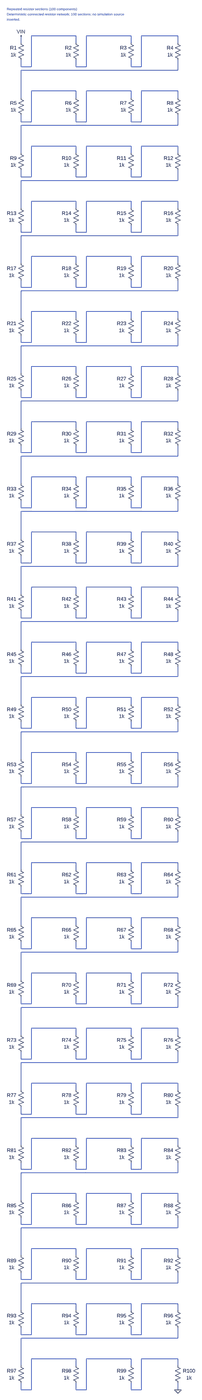
[diagram p0: schematic circuit.asc, whole sheet]
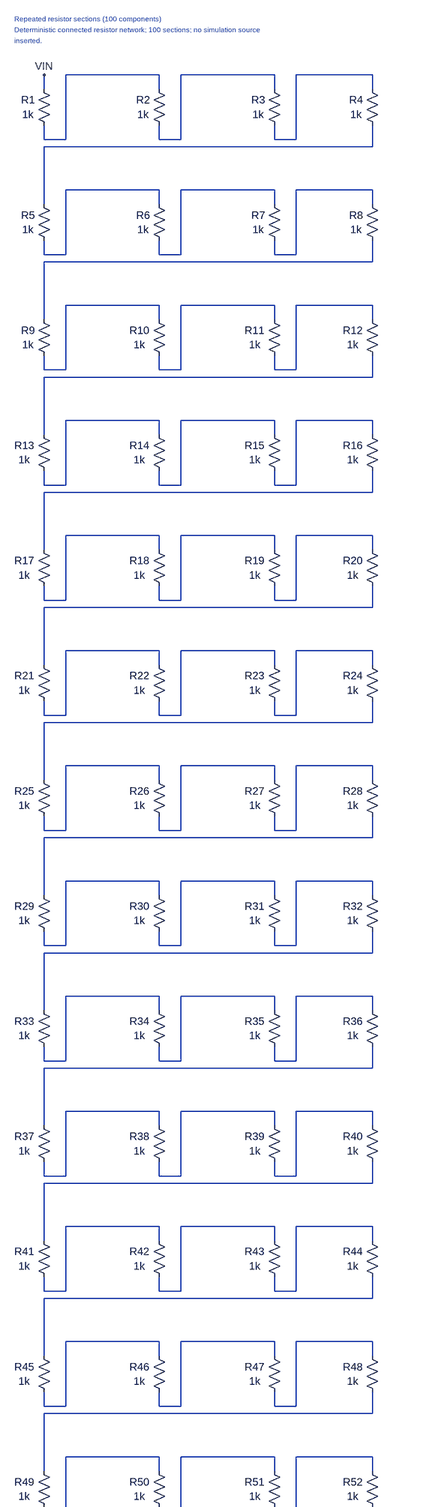
[diagram p1: schematic circuit.asc, part, row 1 of 2, column 1 of 1]
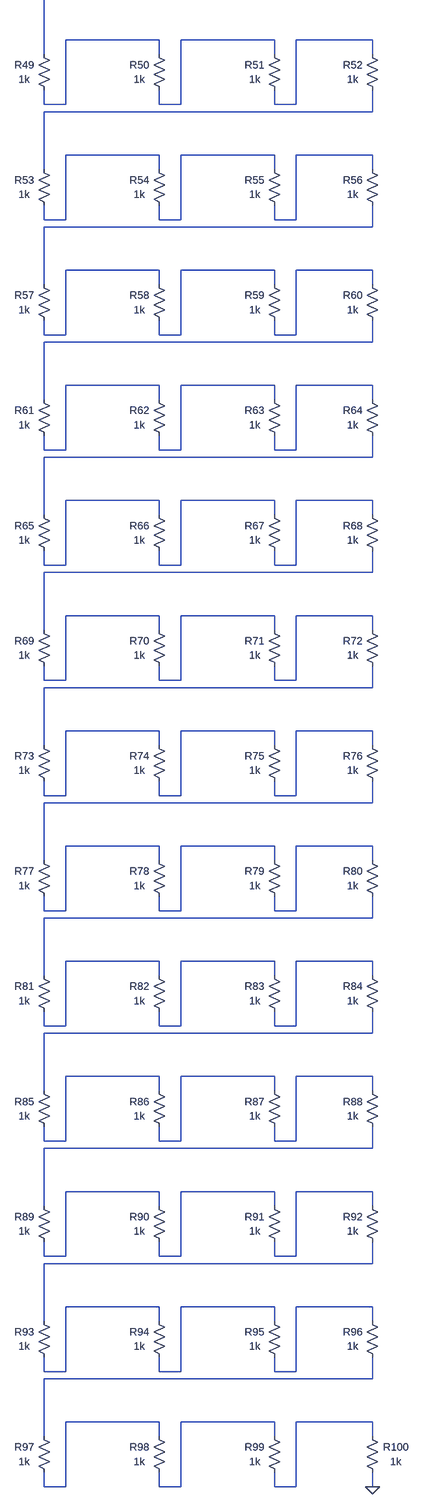
[diagram p2: schematic circuit.asc, part, row 2 of 2, column 1 of 1]
circuit.asc, the LTspice schematic file:
Version 4
SHEET 1 992 6512
SYMBOL res 64 128 R0
WINDOW 0 -20 40 Center 2
WINDOW 3 -20 72 Center 2
SYMATTR InstName R1
SYMATTR Value 1k
SYMBOL res 320 128 R0
WINDOW 0 -20 40 Center 2
WINDOW 3 -20 72 Center 2
SYMATTR InstName R2
SYMATTR Value 1k
SYMBOL res 576 128 R0
WINDOW 0 -20 40 Center 2
WINDOW 3 -20 72 Center 2
SYMATTR InstName R3
SYMATTR Value 1k
SYMBOL res 832 128 R0
WINDOW 0 -20 40 Center 2
WINDOW 3 -20 72 Center 2
SYMATTR InstName R4
SYMATTR Value 1k
SYMBOL res 64 384 R0
WINDOW 0 -20 40 Center 2
WINDOW 3 -20 72 Center 2
SYMATTR InstName R5
SYMATTR Value 1k
SYMBOL res 320 384 R0
WINDOW 0 -20 40 Center 2
WINDOW 3 -20 72 Center 2
SYMATTR InstName R6
SYMATTR Value 1k
SYMBOL res 576 384 R0
WINDOW 0 -20 40 Center 2
WINDOW 3 -20 72 Center 2
SYMATTR InstName R7
SYMATTR Value 1k
SYMBOL res 832 384 R0
WINDOW 0 -20 40 Center 2
WINDOW 3 -20 72 Center 2
SYMATTR InstName R8
SYMATTR Value 1k
SYMBOL res 64 640 R0
WINDOW 0 -20 40 Center 2
WINDOW 3 -20 72 Center 2
SYMATTR InstName R9
SYMATTR Value 1k
SYMBOL res 320 640 R0
WINDOW 0 -28 40 Center 2
WINDOW 3 -28 72 Center 2
SYMATTR InstName R10
SYMATTR Value 1k
SYMBOL res 576 640 R0
WINDOW 0 -28 40 Center 2
WINDOW 3 -28 72 Center 2
SYMATTR InstName R11
SYMATTR Value 1k
SYMBOL res 832 640 R0
WINDOW 0 -28 40 Center 2
WINDOW 3 -28 72 Center 2
SYMATTR InstName R12
SYMATTR Value 1k
SYMBOL res 64 896 R0
WINDOW 0 -28 40 Center 2
WINDOW 3 -28 72 Center 2
SYMATTR InstName R13
SYMATTR Value 1k
SYMBOL res 320 896 R0
WINDOW 0 -28 40 Center 2
WINDOW 3 -28 72 Center 2
SYMATTR InstName R14
SYMATTR Value 1k
SYMBOL res 576 896 R0
WINDOW 0 -28 40 Center 2
WINDOW 3 -28 72 Center 2
SYMATTR InstName R15
SYMATTR Value 1k
SYMBOL res 832 896 R0
WINDOW 0 -28 40 Center 2
WINDOW 3 -28 72 Center 2
SYMATTR InstName R16
SYMATTR Value 1k
SYMBOL res 64 1152 R0
WINDOW 0 -28 40 Center 2
WINDOW 3 -28 72 Center 2
SYMATTR InstName R17
SYMATTR Value 1k
SYMBOL res 320 1152 R0
WINDOW 0 -28 40 Center 2
WINDOW 3 -28 72 Center 2
SYMATTR InstName R18
SYMATTR Value 1k
SYMBOL res 576 1152 R0
WINDOW 0 -28 40 Center 2
WINDOW 3 -28 72 Center 2
SYMATTR InstName R19
SYMATTR Value 1k
SYMBOL res 832 1152 R0
WINDOW 0 -28 40 Center 2
WINDOW 3 -28 72 Center 2
SYMATTR InstName R20
SYMATTR Value 1k
SYMBOL res 64 1408 R0
WINDOW 0 -28 40 Center 2
WINDOW 3 -28 72 Center 2
SYMATTR InstName R21
SYMATTR Value 1k
SYMBOL res 320 1408 R0
WINDOW 0 -28 40 Center 2
WINDOW 3 -28 72 Center 2
SYMATTR InstName R22
SYMATTR Value 1k
SYMBOL res 576 1408 R0
WINDOW 0 -28 40 Center 2
WINDOW 3 -28 72 Center 2
SYMATTR InstName R23
SYMATTR Value 1k
SYMBOL res 832 1408 R0
WINDOW 0 -28 40 Center 2
WINDOW 3 -28 72 Center 2
SYMATTR InstName R24
SYMATTR Value 1k
SYMBOL res 64 1664 R0
WINDOW 0 -28 40 Center 2
WINDOW 3 -28 72 Center 2
SYMATTR InstName R25
SYMATTR Value 1k
SYMBOL res 320 1664 R0
WINDOW 0 -28 40 Center 2
WINDOW 3 -28 72 Center 2
SYMATTR InstName R26
SYMATTR Value 1k
SYMBOL res 576 1664 R0
WINDOW 0 -28 40 Center 2
WINDOW 3 -28 72 Center 2
SYMATTR InstName R27
SYMATTR Value 1k
SYMBOL res 832 1664 R0
WINDOW 0 -28 40 Center 2
WINDOW 3 -28 72 Center 2
SYMATTR InstName R28
SYMATTR Value 1k
SYMBOL res 64 1920 R0
WINDOW 0 -28 40 Center 2
WINDOW 3 -28 72 Center 2
SYMATTR InstName R29
SYMATTR Value 1k
SYMBOL res 320 1920 R0
WINDOW 0 -28 40 Center 2
WINDOW 3 -28 72 Center 2
SYMATTR InstName R30
SYMATTR Value 1k
SYMBOL res 576 1920 R0
WINDOW 0 -28 40 Center 2
WINDOW 3 -28 72 Center 2
SYMATTR InstName R31
SYMATTR Value 1k
SYMBOL res 832 1920 R0
WINDOW 0 -28 40 Center 2
WINDOW 3 -28 72 Center 2
SYMATTR InstName R32
SYMATTR Value 1k
SYMBOL res 64 2176 R0
WINDOW 0 -28 40 Center 2
WINDOW 3 -28 72 Center 2
SYMATTR InstName R33
SYMATTR Value 1k
SYMBOL res 320 2176 R0
WINDOW 0 -28 40 Center 2
WINDOW 3 -28 72 Center 2
SYMATTR InstName R34
SYMATTR Value 1k
SYMBOL res 576 2176 R0
WINDOW 0 -28 40 Center 2
WINDOW 3 -28 72 Center 2
SYMATTR InstName R35
SYMATTR Value 1k
SYMBOL res 832 2176 R0
WINDOW 0 -28 40 Center 2
WINDOW 3 -28 72 Center 2
SYMATTR InstName R36
SYMATTR Value 1k
SYMBOL res 64 2432 R0
WINDOW 0 -28 40 Center 2
WINDOW 3 -28 72 Center 2
SYMATTR InstName R37
SYMATTR Value 1k
SYMBOL res 320 2432 R0
WINDOW 0 -28 40 Center 2
WINDOW 3 -28 72 Center 2
SYMATTR InstName R38
SYMATTR Value 1k
SYMBOL res 576 2432 R0
WINDOW 0 -28 40 Center 2
WINDOW 3 -28 72 Center 2
SYMATTR InstName R39
SYMATTR Value 1k
SYMBOL res 832 2432 R0
WINDOW 0 -28 40 Center 2
WINDOW 3 -28 72 Center 2
SYMATTR InstName R40
SYMATTR Value 1k
SYMBOL res 64 2688 R0
WINDOW 0 -28 40 Center 2
WINDOW 3 -28 72 Center 2
SYMATTR InstName R41
SYMATTR Value 1k
SYMBOL res 320 2688 R0
WINDOW 0 -28 40 Center 2
WINDOW 3 -28 72 Center 2
SYMATTR InstName R42
SYMATTR Value 1k
SYMBOL res 576 2688 R0
WINDOW 0 -28 40 Center 2
WINDOW 3 -28 72 Center 2
SYMATTR InstName R43
SYMATTR Value 1k
SYMBOL res 832 2688 R0
WINDOW 0 -28 40 Center 2
WINDOW 3 -28 72 Center 2
SYMATTR InstName R44
SYMATTR Value 1k
SYMBOL res 64 2944 R0
WINDOW 0 -28 40 Center 2
WINDOW 3 -28 72 Center 2
SYMATTR InstName R45
SYMATTR Value 1k
SYMBOL res 320 2944 R0
WINDOW 0 -28 40 Center 2
WINDOW 3 -28 72 Center 2
SYMATTR InstName R46
SYMATTR Value 1k
SYMBOL res 576 2944 R0
WINDOW 0 -28 40 Center 2
WINDOW 3 -28 72 Center 2
SYMATTR InstName R47
SYMATTR Value 1k
SYMBOL res 832 2944 R0
WINDOW 0 -28 40 Center 2
WINDOW 3 -28 72 Center 2
SYMATTR InstName R48
SYMATTR Value 1k
SYMBOL res 64 3200 R0
WINDOW 0 -28 40 Center 2
WINDOW 3 -28 72 Center 2
SYMATTR InstName R49
SYMATTR Value 1k
SYMBOL res 320 3200 R0
WINDOW 0 -28 40 Center 2
WINDOW 3 -28 72 Center 2
SYMATTR InstName R50
SYMATTR Value 1k
SYMBOL res 576 3200 R0
WINDOW 0 -28 40 Center 2
WINDOW 3 -28 72 Center 2
SYMATTR InstName R51
SYMATTR Value 1k
SYMBOL res 832 3200 R0
WINDOW 0 -28 40 Center 2
WINDOW 3 -28 72 Center 2
SYMATTR InstName R52
SYMATTR Value 1k
SYMBOL res 64 3456 R0
WINDOW 0 -28 40 Center 2
WINDOW 3 -28 72 Center 2
SYMATTR InstName R53
SYMATTR Value 1k
SYMBOL res 320 3456 R0
WINDOW 0 -28 40 Center 2
WINDOW 3 -28 72 Center 2
SYMATTR InstName R54
SYMATTR Value 1k
SYMBOL res 576 3456 R0
WINDOW 0 -28 40 Center 2
WINDOW 3 -28 72 Center 2
SYMATTR InstName R55
SYMATTR Value 1k
SYMBOL res 832 3456 R0
WINDOW 0 -28 40 Center 2
WINDOW 3 -28 72 Center 2
SYMATTR InstName R56
SYMATTR Value 1k
SYMBOL res 64 3712 R0
WINDOW 0 -28 40 Center 2
WINDOW 3 -28 72 Center 2
SYMATTR InstName R57
SYMATTR Value 1k
SYMBOL res 320 3712 R0
WINDOW 0 -28 40 Center 2
WINDOW 3 -28 72 Center 2
SYMATTR InstName R58
SYMATTR Value 1k
SYMBOL res 576 3712 R0
WINDOW 0 -28 40 Center 2
WINDOW 3 -28 72 Center 2
SYMATTR InstName R59
SYMATTR Value 1k
SYMBOL res 832 3712 R0
WINDOW 0 -28 40 Center 2
WINDOW 3 -28 72 Center 2
SYMATTR InstName R60
SYMATTR Value 1k
SYMBOL res 64 3968 R0
WINDOW 0 -28 40 Center 2
WINDOW 3 -28 72 Center 2
SYMATTR InstName R61
SYMATTR Value 1k
SYMBOL res 320 3968 R0
WINDOW 0 -28 40 Center 2
WINDOW 3 -28 72 Center 2
SYMATTR InstName R62
SYMATTR Value 1k
SYMBOL res 576 3968 R0
WINDOW 0 -28 40 Center 2
WINDOW 3 -28 72 Center 2
SYMATTR InstName R63
SYMATTR Value 1k
SYMBOL res 832 3968 R0
WINDOW 0 -28 40 Center 2
WINDOW 3 -28 72 Center 2
SYMATTR InstName R64
SYMATTR Value 1k
SYMBOL res 64 4224 R0
WINDOW 0 -28 40 Center 2
WINDOW 3 -28 72 Center 2
SYMATTR InstName R65
SYMATTR Value 1k
SYMBOL res 320 4224 R0
WINDOW 0 -28 40 Center 2
WINDOW 3 -28 72 Center 2
SYMATTR InstName R66
SYMATTR Value 1k
SYMBOL res 576 4224 R0
WINDOW 0 -28 40 Center 2
WINDOW 3 -28 72 Center 2
SYMATTR InstName R67
SYMATTR Value 1k
SYMBOL res 832 4224 R0
WINDOW 0 -28 40 Center 2
WINDOW 3 -28 72 Center 2
SYMATTR InstName R68
SYMATTR Value 1k
SYMBOL res 64 4480 R0
WINDOW 0 -28 40 Center 2
WINDOW 3 -28 72 Center 2
SYMATTR InstName R69
SYMATTR Value 1k
SYMBOL res 320 4480 R0
WINDOW 0 -28 40 Center 2
WINDOW 3 -28 72 Center 2
SYMATTR InstName R70
SYMATTR Value 1k
SYMBOL res 576 4480 R0
WINDOW 0 -28 40 Center 2
WINDOW 3 -28 72 Center 2
SYMATTR InstName R71
SYMATTR Value 1k
SYMBOL res 832 4480 R0
WINDOW 0 -28 40 Center 2
WINDOW 3 -28 72 Center 2
SYMATTR InstName R72
SYMATTR Value 1k
SYMBOL res 64 4736 R0
WINDOW 0 -28 40 Center 2
WINDOW 3 -28 72 Center 2
SYMATTR InstName R73
SYMATTR Value 1k
SYMBOL res 320 4736 R0
WINDOW 0 -28 40 Center 2
WINDOW 3 -28 72 Center 2
SYMATTR InstName R74
SYMATTR Value 1k
SYMBOL res 576 4736 R0
WINDOW 0 -28 40 Center 2
WINDOW 3 -28 72 Center 2
SYMATTR InstName R75
SYMATTR Value 1k
SYMBOL res 832 4736 R0
WINDOW 0 -28 40 Center 2
WINDOW 3 -28 72 Center 2
SYMATTR InstName R76
SYMATTR Value 1k
SYMBOL res 64 4992 R0
WINDOW 0 -28 40 Center 2
WINDOW 3 -28 72 Center 2
SYMATTR InstName R77
SYMATTR Value 1k
SYMBOL res 320 4992 R0
WINDOW 0 -28 40 Center 2
WINDOW 3 -28 72 Center 2
SYMATTR InstName R78
SYMATTR Value 1k
SYMBOL res 576 4992 R0
WINDOW 0 -28 40 Center 2
WINDOW 3 -28 72 Center 2
SYMATTR InstName R79
SYMATTR Value 1k
SYMBOL res 832 4992 R0
WINDOW 0 -28 40 Center 2
WINDOW 3 -28 72 Center 2
SYMATTR InstName R80
SYMATTR Value 1k
SYMBOL res 64 5248 R0
WINDOW 0 -28 40 Center 2
WINDOW 3 -28 72 Center 2
SYMATTR InstName R81
SYMATTR Value 1k
SYMBOL res 320 5248 R0
WINDOW 0 -28 40 Center 2
WINDOW 3 -28 72 Center 2
SYMATTR InstName R82
SYMATTR Value 1k
SYMBOL res 576 5248 R0
WINDOW 0 -28 40 Center 2
WINDOW 3 -28 72 Center 2
SYMATTR InstName R83
SYMATTR Value 1k
SYMBOL res 832 5248 R0
WINDOW 0 -28 40 Center 2
WINDOW 3 -28 72 Center 2
SYMATTR InstName R84
SYMATTR Value 1k
SYMBOL res 64 5504 R0
WINDOW 0 -28 40 Center 2
WINDOW 3 -28 72 Center 2
SYMATTR InstName R85
SYMATTR Value 1k
SYMBOL res 320 5504 R0
WINDOW 0 -28 40 Center 2
WINDOW 3 -28 72 Center 2
SYMATTR InstName R86
SYMATTR Value 1k
SYMBOL res 576 5504 R0
WINDOW 0 -28 40 Center 2
WINDOW 3 -28 72 Center 2
SYMATTR InstName R87
SYMATTR Value 1k
SYMBOL res 832 5504 R0
WINDOW 0 -28 40 Center 2
WINDOW 3 -28 72 Center 2
SYMATTR InstName R88
SYMATTR Value 1k
SYMBOL res 64 5760 R0
WINDOW 0 -28 40 Center 2
WINDOW 3 -28 72 Center 2
SYMATTR InstName R89
SYMATTR Value 1k
SYMBOL res 320 5760 R0
WINDOW 0 -28 40 Center 2
WINDOW 3 -28 72 Center 2
SYMATTR InstName R90
SYMATTR Value 1k
SYMBOL res 576 5760 R0
WINDOW 0 -28 40 Center 2
WINDOW 3 -28 72 Center 2
SYMATTR InstName R91
SYMATTR Value 1k
SYMBOL res 832 5760 R0
WINDOW 0 -28 40 Center 2
WINDOW 3 -28 72 Center 2
SYMATTR InstName R92
SYMATTR Value 1k
SYMBOL res 64 6016 R0
WINDOW 0 -28 40 Center 2
WINDOW 3 -28 72 Center 2
SYMATTR InstName R93
SYMATTR Value 1k
SYMBOL res 320 6016 R0
WINDOW 0 -28 40 Center 2
WINDOW 3 -28 72 Center 2
SYMATTR InstName R94
SYMATTR Value 1k
SYMBOL res 576 6016 R0
WINDOW 0 -28 40 Center 2
WINDOW 3 -28 72 Center 2
SYMATTR InstName R95
SYMATTR Value 1k
SYMBOL res 832 6016 R0
WINDOW 0 -28 40 Center 2
WINDOW 3 -28 72 Center 2
SYMATTR InstName R96
SYMATTR Value 1k
SYMBOL res 64 6272 R0
WINDOW 0 -28 40 Center 2
WINDOW 3 -28 72 Center 2
SYMATTR InstName R97
SYMATTR Value 1k
SYMBOL res 320 6272 R0
WINDOW 0 -28 40 Center 2
WINDOW 3 -28 72 Center 2
SYMATTR InstName R98
SYMATTR Value 1k
SYMBOL res 576 6272 R0
WINDOW 0 -28 40 Center 2
WINDOW 3 -28 72 Center 2
SYMATTR InstName R99
SYMATTR Value 1k
SYMBOL res 832 6272 R0
WINDOW 0 68 40 Center 2
WINDOW 3 68 72 Center 2
SYMATTR InstName R100
SYMATTR Value 1k
WIRE 80 112 80 144
WIRE 80 224 80 256
WIRE 80 256 128 256
WIRE 80 272 80 400
WIRE 80 272 848 272
WIRE 80 480 80 512
WIRE 80 512 128 512
WIRE 80 528 80 656
WIRE 80 528 848 528
WIRE 80 736 80 768
WIRE 80 768 128 768
WIRE 80 784 80 912
WIRE 80 784 848 784
WIRE 80 992 80 1024
WIRE 80 1024 128 1024
WIRE 80 1040 80 1168
WIRE 80 1040 848 1040
WIRE 80 1248 80 1280
WIRE 80 1280 128 1280
WIRE 80 1296 80 1424
WIRE 80 1296 848 1296
WIRE 80 1504 80 1536
WIRE 80 1536 128 1536
WIRE 80 1552 80 1680
WIRE 80 1552 848 1552
WIRE 80 1760 80 1792
WIRE 80 1792 128 1792
WIRE 80 1808 80 1936
WIRE 80 1808 848 1808
WIRE 80 2016 80 2048
WIRE 80 2048 128 2048
WIRE 80 2064 80 2192
WIRE 80 2064 848 2064
WIRE 80 2272 80 2304
WIRE 80 2304 128 2304
WIRE 80 2320 80 2448
WIRE 80 2320 848 2320
WIRE 80 2528 80 2560
WIRE 80 2560 128 2560
WIRE 80 2576 80 2704
WIRE 80 2576 848 2576
WIRE 80 2784 80 2816
WIRE 80 2816 128 2816
WIRE 80 2832 80 2960
WIRE 80 2832 848 2832
WIRE 80 3040 80 3072
WIRE 80 3072 128 3072
WIRE 80 3088 80 3216
WIRE 80 3088 848 3088
WIRE 80 3296 80 3328
WIRE 80 3328 128 3328
WIRE 80 3344 80 3472
WIRE 80 3344 848 3344
WIRE 80 3552 80 3584
WIRE 80 3584 128 3584
WIRE 80 3600 80 3728
WIRE 80 3600 848 3600
WIRE 80 3808 80 3840
WIRE 80 3840 128 3840
WIRE 80 3856 80 3984
WIRE 80 3856 848 3856
WIRE 80 4064 80 4096
WIRE 80 4096 128 4096
WIRE 80 4112 80 4240
WIRE 80 4112 848 4112
WIRE 80 4320 80 4352
WIRE 80 4352 128 4352
WIRE 80 4368 80 4496
WIRE 80 4368 848 4368
WIRE 80 4576 80 4608
WIRE 80 4608 128 4608
WIRE 80 4624 80 4752
WIRE 80 4624 848 4624
WIRE 80 4832 80 4864
WIRE 80 4864 128 4864
WIRE 80 4880 80 5008
WIRE 80 4880 848 4880
WIRE 80 5088 80 5120
WIRE 80 5120 128 5120
WIRE 80 5136 80 5264
WIRE 80 5136 848 5136
WIRE 80 5344 80 5376
WIRE 80 5376 128 5376
WIRE 80 5392 80 5520
WIRE 80 5392 848 5392
WIRE 80 5600 80 5632
WIRE 80 5632 128 5632
WIRE 80 5648 80 5776
WIRE 80 5648 848 5648
WIRE 80 5856 80 5888
WIRE 80 5888 128 5888
WIRE 80 5904 80 6032
WIRE 80 5904 848 5904
WIRE 80 6112 80 6144
WIRE 80 6144 128 6144
WIRE 80 6160 80 6288
WIRE 80 6160 848 6160
WIRE 80 6368 80 6400
WIRE 80 6400 128 6400
WIRE 128 112 128 256
WIRE 128 112 336 112
WIRE 128 368 128 512
WIRE 128 368 336 368
WIRE 128 624 128 768
WIRE 128 624 336 624
WIRE 128 880 128 1024
WIRE 128 880 336 880
WIRE 128 1136 128 1280
WIRE 128 1136 336 1136
WIRE 128 1392 128 1536
WIRE 128 1392 336 1392
WIRE 128 1648 128 1792
WIRE 128 1648 336 1648
WIRE 128 1904 128 2048
WIRE 128 1904 336 1904
WIRE 128 2160 128 2304
WIRE 128 2160 336 2160
WIRE 128 2416 128 2560
WIRE 128 2416 336 2416
WIRE 128 2672 128 2816
WIRE 128 2672 336 2672
WIRE 128 2928 128 3072
WIRE 128 2928 336 2928
WIRE 128 3184 128 3328
WIRE 128 3184 336 3184
WIRE 128 3440 128 3584
WIRE 128 3440 336 3440
WIRE 128 3696 128 3840
WIRE 128 3696 336 3696
WIRE 128 3952 128 4096
WIRE 128 3952 336 3952
WIRE 128 4208 128 4352
WIRE 128 4208 336 4208
WIRE 128 4464 128 4608
WIRE 128 4464 336 4464
WIRE 128 4720 128 4864
WIRE 128 4720 336 4720
WIRE 128 4976 128 5120
WIRE 128 4976 336 4976
WIRE 128 5232 128 5376
WIRE 128 5232 336 5232
WIRE 128 5488 128 5632
WIRE 128 5488 336 5488
WIRE 128 5744 128 5888
WIRE 128 5744 336 5744
WIRE 128 6000 128 6144
WIRE 128 6000 336 6000
WIRE 128 6256 128 6400
WIRE 128 6256 336 6256
WIRE 336 112 336 144
WIRE 336 224 336 256
WIRE 336 256 384 256
WIRE 336 368 336 400
WIRE 336 480 336 512
WIRE 336 512 384 512
WIRE 336 624 336 656
WIRE 336 736 336 768
WIRE 336 768 384 768
WIRE 336 880 336 912
WIRE 336 992 336 1024
WIRE 336 1024 384 1024
WIRE 336 1136 336 1168
WIRE 336 1248 336 1280
WIRE 336 1280 384 1280
WIRE 336 1392 336 1424
WIRE 336 1504 336 1536
WIRE 336 1536 384 1536
WIRE 336 1648 336 1680
WIRE 336 1760 336 1792
WIRE 336 1792 384 1792
WIRE 336 1904 336 1936
WIRE 336 2016 336 2048
WIRE 336 2048 384 2048
WIRE 336 2160 336 2192
WIRE 336 2272 336 2304
WIRE 336 2304 384 2304
WIRE 336 2416 336 2448
WIRE 336 2528 336 2560
WIRE 336 2560 384 2560
WIRE 336 2672 336 2704
WIRE 336 2784 336 2816
WIRE 336 2816 384 2816
WIRE 336 2928 336 2960
WIRE 336 3040 336 3072
WIRE 336 3072 384 3072
WIRE 336 3184 336 3216
WIRE 336 3296 336 3328
WIRE 336 3328 384 3328
WIRE 336 3440 336 3472
WIRE 336 3552 336 3584
WIRE 336 3584 384 3584
WIRE 336 3696 336 3728
WIRE 336 3808 336 3840
WIRE 336 3840 384 3840
WIRE 336 3952 336 3984
WIRE 336 4064 336 4096
WIRE 336 4096 384 4096
WIRE 336 4208 336 4240
WIRE 336 4320 336 4352
WIRE 336 4352 384 4352
WIRE 336 4464 336 4496
WIRE 336 4576 336 4608
WIRE 336 4608 384 4608
WIRE 336 4720 336 4752
WIRE 336 4832 336 4864
WIRE 336 4864 384 4864
WIRE 336 4976 336 5008
WIRE 336 5088 336 5120
WIRE 336 5120 384 5120
WIRE 336 5232 336 5264
WIRE 336 5344 336 5376
WIRE 336 5376 384 5376
WIRE 336 5488 336 5520
WIRE 336 5600 336 5632
WIRE 336 5632 384 5632
WIRE 336 5744 336 5776
WIRE 336 5856 336 5888
WIRE 336 5888 384 5888
WIRE 336 6000 336 6032
WIRE 336 6112 336 6144
WIRE 336 6144 384 6144
WIRE 336 6256 336 6288
WIRE 336 6368 336 6400
WIRE 336 6400 384 6400
WIRE 384 112 384 256
WIRE 384 112 592 112
WIRE 384 368 384 512
WIRE 384 368 592 368
WIRE 384 624 384 768
WIRE 384 624 592 624
WIRE 384 880 384 1024
WIRE 384 880 592 880
WIRE 384 1136 384 1280
WIRE 384 1136 592 1136
WIRE 384 1392 384 1536
WIRE 384 1392 592 1392
WIRE 384 1648 384 1792
WIRE 384 1648 592 1648
WIRE 384 1904 384 2048
WIRE 384 1904 592 1904
WIRE 384 2160 384 2304
WIRE 384 2160 592 2160
WIRE 384 2416 384 2560
WIRE 384 2416 592 2416
WIRE 384 2672 384 2816
WIRE 384 2672 592 2672
WIRE 384 2928 384 3072
WIRE 384 2928 592 2928
WIRE 384 3184 384 3328
WIRE 384 3184 592 3184
WIRE 384 3440 384 3584
WIRE 384 3440 592 3440
WIRE 384 3696 384 3840
WIRE 384 3696 592 3696
WIRE 384 3952 384 4096
WIRE 384 3952 592 3952
WIRE 384 4208 384 4352
WIRE 384 4208 592 4208
WIRE 384 4464 384 4608
WIRE 384 4464 592 4464
WIRE 384 4720 384 4864
WIRE 384 4720 592 4720
WIRE 384 4976 384 5120
WIRE 384 4976 592 4976
WIRE 384 5232 384 5376
WIRE 384 5232 592 5232
WIRE 384 5488 384 5632
WIRE 384 5488 592 5488
WIRE 384 5744 384 5888
WIRE 384 5744 592 5744
WIRE 384 6000 384 6144
WIRE 384 6000 592 6000
WIRE 384 6256 384 6400
WIRE 384 6256 592 6256
WIRE 592 112 592 144
WIRE 592 224 592 256
WIRE 592 256 640 256
WIRE 592 368 592 400
WIRE 592 480 592 512
WIRE 592 512 640 512
WIRE 592 624 592 656
WIRE 592 736 592 768
WIRE 592 768 640 768
WIRE 592 880 592 912
WIRE 592 992 592 1024
WIRE 592 1024 640 1024
WIRE 592 1136 592 1168
WIRE 592 1248 592 1280
WIRE 592 1280 640 1280
WIRE 592 1392 592 1424
WIRE 592 1504 592 1536
WIRE 592 1536 640 1536
WIRE 592 1648 592 1680
WIRE 592 1760 592 1792
WIRE 592 1792 640 1792
WIRE 592 1904 592 1936
WIRE 592 2016 592 2048
WIRE 592 2048 640 2048
WIRE 592 2160 592 2192
WIRE 592 2272 592 2304
WIRE 592 2304 640 2304
WIRE 592 2416 592 2448
WIRE 592 2528 592 2560
WIRE 592 2560 640 2560
WIRE 592 2672 592 2704
WIRE 592 2784 592 2816
WIRE 592 2816 640 2816
WIRE 592 2928 592 2960
WIRE 592 3040 592 3072
WIRE 592 3072 640 3072
WIRE 592 3184 592 3216
WIRE 592 3296 592 3328
WIRE 592 3328 640 3328
WIRE 592 3440 592 3472
WIRE 592 3552 592 3584
WIRE 592 3584 640 3584
WIRE 592 3696 592 3728
WIRE 592 3808 592 3840
WIRE 592 3840 640 3840
WIRE 592 3952 592 3984
WIRE 592 4064 592 4096
WIRE 592 4096 640 4096
WIRE 592 4208 592 4240
WIRE 592 4320 592 4352
WIRE 592 4352 640 4352
WIRE 592 4464 592 4496
WIRE 592 4576 592 4608
WIRE 592 4608 640 4608
WIRE 592 4720 592 4752
WIRE 592 4832 592 4864
WIRE 592 4864 640 4864
WIRE 592 4976 592 5008
WIRE 592 5088 592 5120
WIRE 592 5120 640 5120
WIRE 592 5232 592 5264
WIRE 592 5344 592 5376
WIRE 592 5376 640 5376
WIRE 592 5488 592 5520
WIRE 592 5600 592 5632
WIRE 592 5632 640 5632
WIRE 592 5744 592 5776
WIRE 592 5856 592 5888
WIRE 592 5888 640 5888
WIRE 592 6000 592 6032
WIRE 592 6112 592 6144
WIRE 592 6144 640 6144
WIRE 592 6256 592 6288
WIRE 592 6368 592 6400
WIRE 592 6400 640 6400
WIRE 640 112 640 256
WIRE 640 112 848 112
WIRE 640 368 640 512
WIRE 640 368 848 368
WIRE 640 624 640 768
WIRE 640 624 848 624
WIRE 640 880 640 1024
WIRE 640 880 848 880
WIRE 640 1136 640 1280
WIRE 640 1136 848 1136
WIRE 640 1392 640 1536
WIRE 640 1392 848 1392
WIRE 640 1648 640 1792
WIRE 640 1648 848 1648
WIRE 640 1904 640 2048
WIRE 640 1904 848 1904
WIRE 640 2160 640 2304
WIRE 640 2160 848 2160
WIRE 640 2416 640 2560
WIRE 640 2416 848 2416
WIRE 640 2672 640 2816
WIRE 640 2672 848 2672
WIRE 640 2928 640 3072
WIRE 640 2928 848 2928
WIRE 640 3184 640 3328
WIRE 640 3184 848 3184
WIRE 640 3440 640 3584
WIRE 640 3440 848 3440
WIRE 640 3696 640 3840
WIRE 640 3696 848 3696
WIRE 640 3952 640 4096
WIRE 640 3952 848 3952
WIRE 640 4208 640 4352
WIRE 640 4208 848 4208
WIRE 640 4464 640 4608
WIRE 640 4464 848 4464
WIRE 640 4720 640 4864
WIRE 640 4720 848 4720
WIRE 640 4976 640 5120
WIRE 640 4976 848 4976
WIRE 640 5232 640 5376
WIRE 640 5232 848 5232
WIRE 640 5488 640 5632
WIRE 640 5488 848 5488
WIRE 640 5744 640 5888
WIRE 640 5744 848 5744
WIRE 640 6000 640 6144
WIRE 640 6000 848 6000
WIRE 640 6256 640 6400
WIRE 640 6256 848 6256
WIRE 848 112 848 144
WIRE 848 224 848 272
WIRE 848 368 848 400
WIRE 848 480 848 528
WIRE 848 624 848 656
WIRE 848 736 848 784
WIRE 848 880 848 912
WIRE 848 992 848 1040
WIRE 848 1136 848 1168
WIRE 848 1248 848 1296
WIRE 848 1392 848 1424
WIRE 848 1504 848 1552
WIRE 848 1648 848 1680
WIRE 848 1760 848 1808
WIRE 848 1904 848 1936
WIRE 848 2016 848 2064
WIRE 848 2160 848 2192
WIRE 848 2272 848 2320
WIRE 848 2416 848 2448
WIRE 848 2528 848 2576
WIRE 848 2672 848 2704
WIRE 848 2784 848 2832
WIRE 848 2928 848 2960
WIRE 848 3040 848 3088
WIRE 848 3184 848 3216
WIRE 848 3296 848 3344
WIRE 848 3440 848 3472
WIRE 848 3552 848 3600
WIRE 848 3696 848 3728
WIRE 848 3808 848 3856
WIRE 848 3952 848 3984
WIRE 848 4064 848 4112
WIRE 848 4208 848 4240
WIRE 848 4320 848 4368
WIRE 848 4464 848 4496
WIRE 848 4576 848 4624
WIRE 848 4720 848 4752
WIRE 848 4832 848 4880
WIRE 848 4976 848 5008
WIRE 848 5088 848 5136
WIRE 848 5232 848 5264
WIRE 848 5344 848 5392
WIRE 848 5488 848 5520
WIRE 848 5600 848 5648
WIRE 848 5744 848 5776
WIRE 848 5856 848 5904
WIRE 848 6000 848 6032
WIRE 848 6112 848 6160
WIRE 848 6256 848 6288
WIRE 848 6368 848 6400
FLAG 848 6400 0
FLAG 80 112 VIN
TEXT 14 -12 Left 1 ;Repeated resistor sections (100 components)
TEXT 14 12 Left 1 ;Deterministic connected resistor network; 100 sections; no simulation source
TEXT 14 36 Left 1 ;inserted.

The netlist it stands for:
* circuit.asc
R1 VIN N001 1k
R2 N001 N050 1k
R3 N050 N075 1k
R4 N075 N002 1k
R5 N002 N003 1k
R6 N003 N051 1k
R7 N051 N076 1k
R8 N076 N004 1k
R9 N004 N005 1k
R10 N005 N052 1k
R11 N052 N077 1k
R12 N077 N006 1k
R13 N006 N007 1k
R14 N007 N053 1k
R15 N053 N078 1k
R16 N078 N008 1k
R17 N008 N009 1k
R18 N009 N054 1k
R19 N054 N079 1k
R20 N079 N010 1k
R21 N010 N011 1k
R22 N011 N055 1k
R23 N055 N080 1k
R24 N080 N012 1k
R25 N012 N013 1k
R26 N013 N056 1k
R27 N056 N081 1k
R28 N081 N014 1k
R29 N014 N015 1k
R30 N015 N057 1k
R31 N057 N082 1k
R32 N082 N016 1k
R33 N016 N017 1k
R34 N017 N058 1k
R35 N058 N083 1k
R36 N083 N018 1k
R37 N018 N019 1k
R38 N019 N059 1k
R39 N059 N084 1k
R40 N084 N020 1k
R41 N020 N021 1k
R42 N021 N060 1k
R43 N060 N085 1k
R44 N085 N022 1k
R45 N022 N023 1k
R46 N023 N061 1k
R47 N061 N086 1k
R48 N086 N024 1k
R49 N024 N025 1k
R50 N025 N062 1k
R51 N062 N087 1k
R52 N087 N026 1k
R53 N026 N027 1k
R54 N027 N063 1k
R55 N063 N088 1k
R56 N088 N028 1k
R57 N028 N029 1k
R58 N029 N064 1k
R59 N064 N089 1k
R60 N089 N030 1k
R61 N030 N031 1k
R62 N031 N065 1k
R63 N065 N090 1k
R64 N090 N032 1k
R65 N032 N033 1k
R66 N033 N066 1k
R67 N066 N091 1k
R68 N091 N034 1k
R69 N034 N035 1k
R70 N035 N067 1k
R71 N067 N092 1k
R72 N092 N036 1k
R73 N036 N037 1k
R74 N037 N068 1k
R75 N068 N093 1k
R76 N093 N038 1k
R77 N038 N039 1k
R78 N039 N069 1k
R79 N069 N094 1k
R80 N094 N040 1k
R81 N040 N041 1k
R82 N041 N070 1k
R83 N070 N095 1k
R84 N095 N042 1k
R85 N042 N043 1k
R86 N043 N071 1k
R87 N071 N096 1k
R88 N096 N044 1k
R89 N044 N045 1k
R90 N045 N072 1k
R91 N072 N097 1k
R92 N097 N046 1k
R93 N046 N047 1k
R94 N047 N073 1k
R95 N073 N098 1k
R96 N098 N048 1k
R97 N048 N049 1k
R98 N049 N074 1k
R99 N074 N099 1k
R100 N099 0 1k
* Repeated resistor sections (100 components)
* Deterministic connected resistor network; 100 sections; no simulation source
* inserted.
.backanno
.end